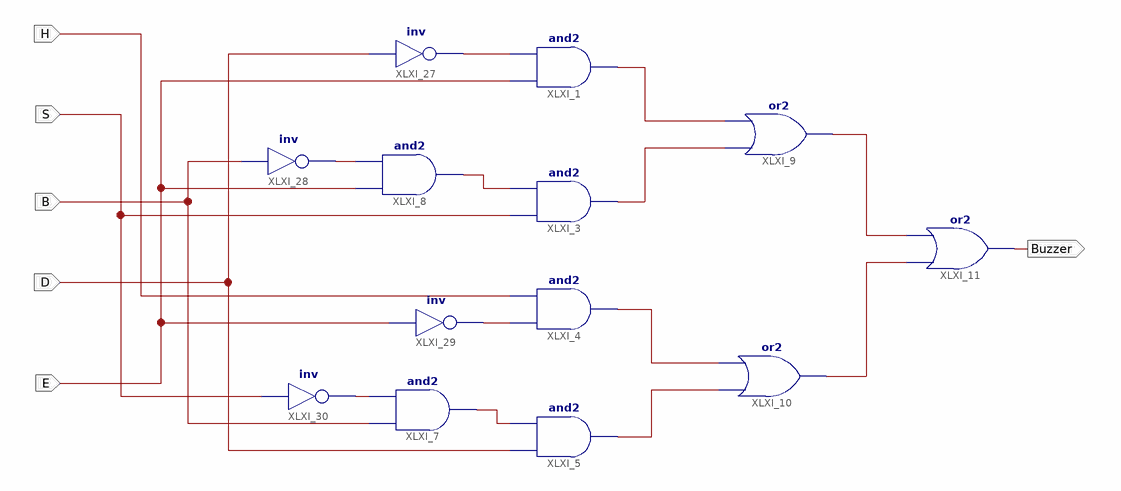
[diagram p0: schematic sheet 1]
// Xilinx ISE schematic Buzzer.sch (spartan6) as structural Verilog: 13 symbols, 6 ports
module Buzzer (
  input  H,
  input  S,
  input  B,
  input  D,
  input  E,
  output Buzzer
);

  wire XLXN_1, XLXN_3, XLXN_4, XLXN_5, XLXN_7, XLXN_8, XLXN_11, XLXN_12, XLXN_13, XLXN_14, XLXN_15, XLXN_21;

  and XLXI_1 (XLXN_4, E, XLXN_13);
  and XLXI_3 (XLXN_5, S, XLXN_21);
  or XLXI_9 (XLXN_1, XLXN_5, XLXN_4);
  or XLXI_11 (Buzzer, XLXN_3, XLXN_1);
  and XLXI_4 (XLXN_7, XLXN_11, H);
  and XLXI_5 (XLXN_8, D, XLXN_15);
  and XLXI_7 (XLXN_15, B, XLXN_14);
  or XLXI_10 (XLXN_3, XLXN_8, XLXN_7);
  not XLXI_27 (XLXN_13, D);
  not XLXI_28 (XLXN_12, B);
  not XLXI_29 (XLXN_11, E);
  not XLXI_30 (XLXN_14, S);
  and XLXI_8 (XLXN_21, E, XLXN_12);
endmodule
